# Altium schematic sheet Motor1_PCIe.SchDoc
size B
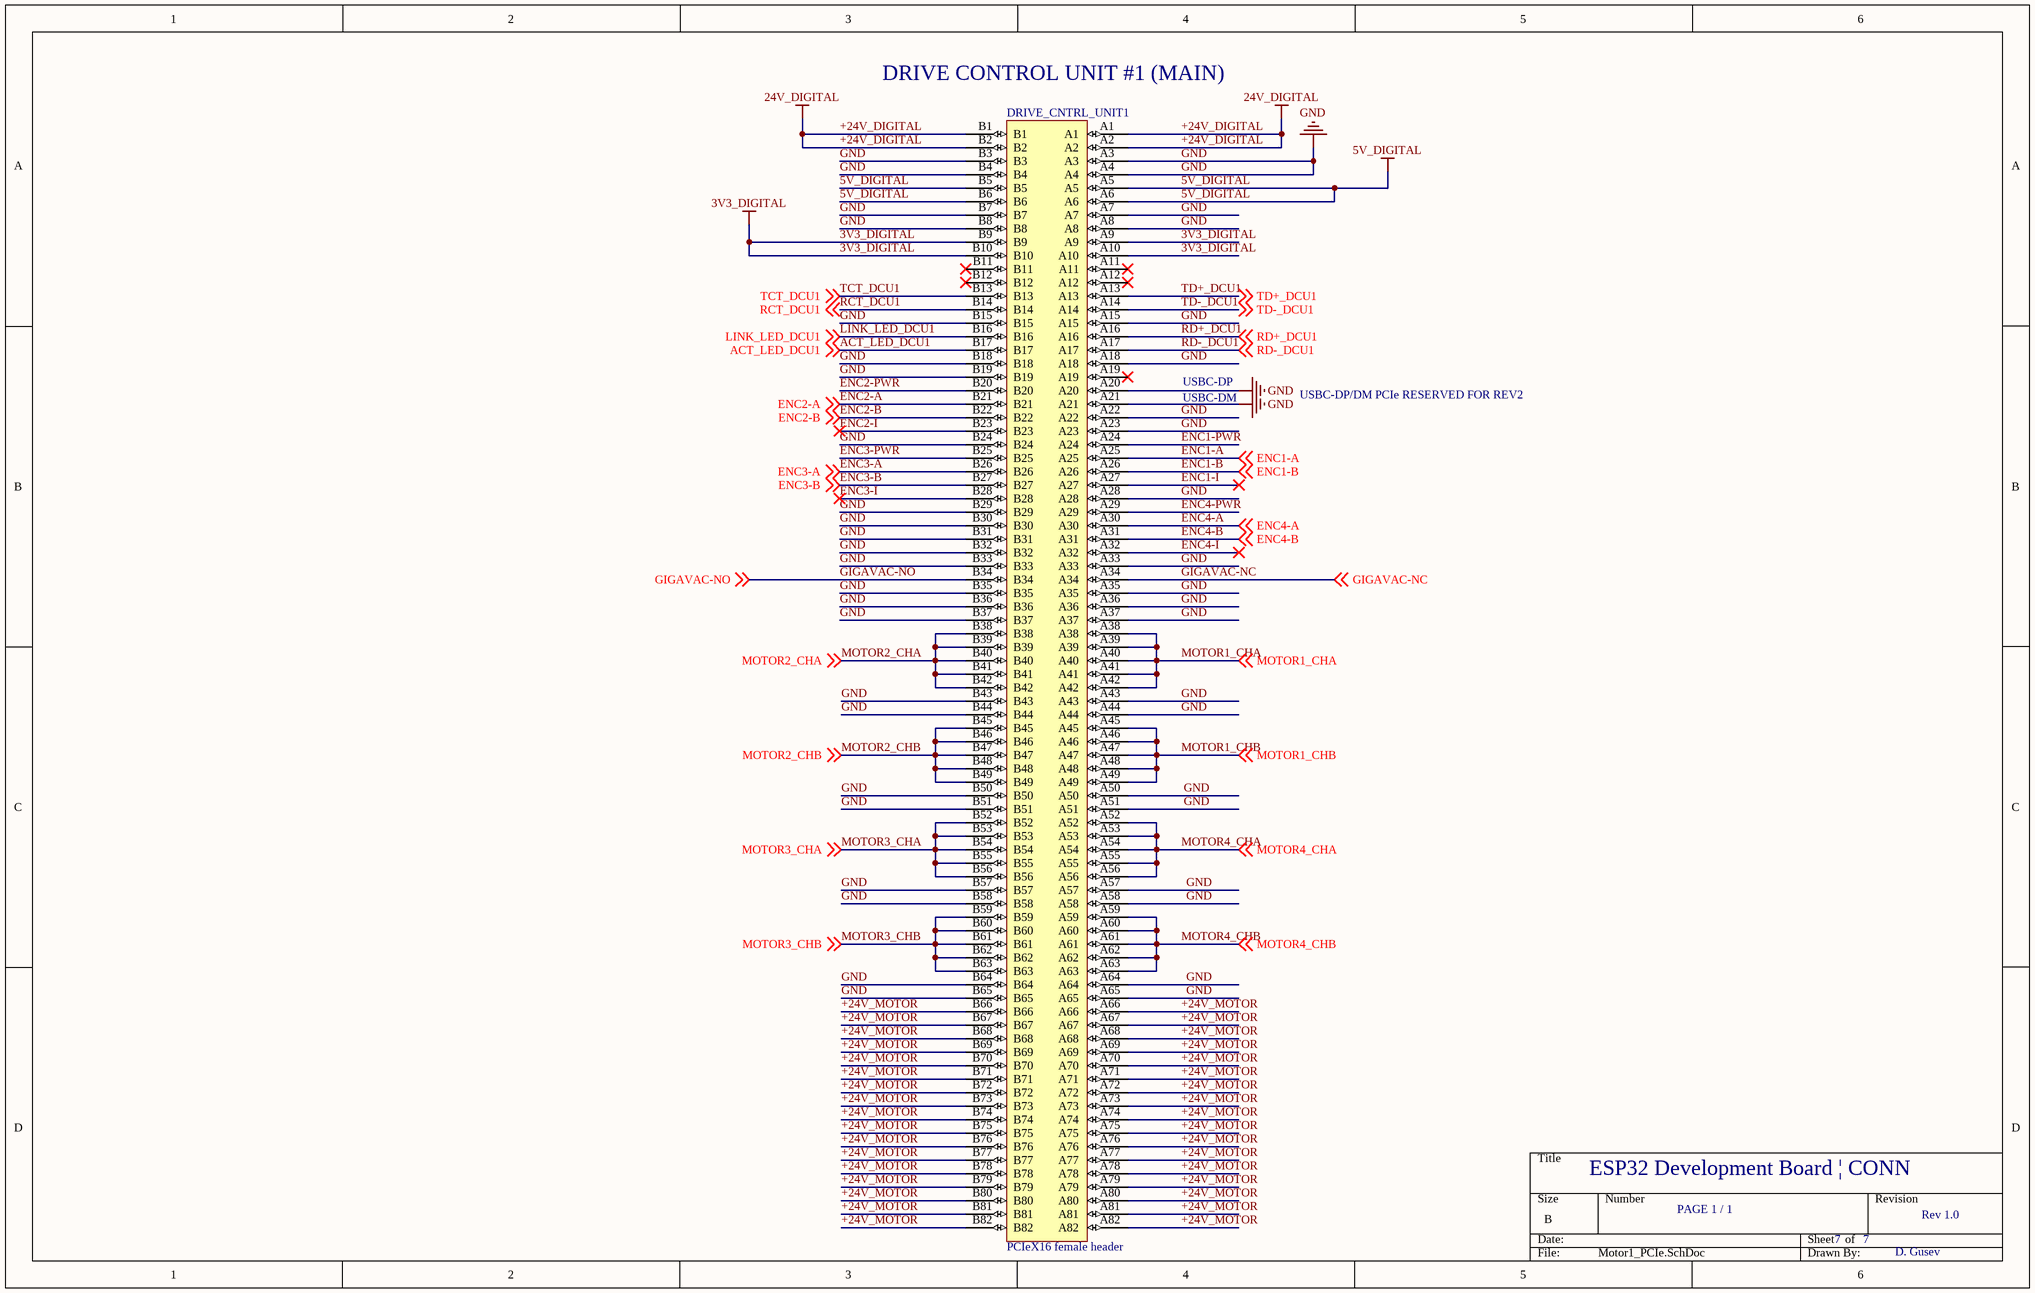
[diagram p0: Motor1_PCIe.SchDoc]

## Parts
DRIVE_CNTRL_UNIT1  PCIeX16 female header  [SAMTEC_PCIE-164-02-X-D-TH]

## Nets
3V3_DIGITAL: DRIVE_CNTRL_UNIT1.A9 DRIVE_CNTRL_UNIT1.A10 DRIVE_CNTRL_UNIT1.B9 DRIVE_CNTRL_UNIT1.B10
5V_DIGITAL: DRIVE_CNTRL_UNIT1.A5 DRIVE_CNTRL_UNIT1.A6 DRIVE_CNTRL_UNIT1.B5 DRIVE_CNTRL_UNIT1.B6
+24V_DIGITAL: DRIVE_CNTRL_UNIT1.A1 DRIVE_CNTRL_UNIT1.A2 DRIVE_CNTRL_UNIT1.B1 DRIVE_CNTRL_UNIT1.B2  [also labelled 24V_DIGITAL]
GND: DRIVE_CNTRL_UNIT1.A3 DRIVE_CNTRL_UNIT1.A4 DRIVE_CNTRL_UNIT1.A7 DRIVE_CNTRL_UNIT1.A8 DRIVE_CNTRL_UNIT1.A15 DRIVE_CNTRL_UNIT1.A18 DRIVE_CNTRL_UNIT1.A20 DRIVE_CNTRL_UNIT1.A21 DRIVE_CNTRL_UNIT1.A22 DRIVE_CNTRL_UNIT1.A23 DRIVE_CNTRL_UNIT1.A28 DRIVE_CNTRL_UNIT1.A33 DRIVE_CNTRL_UNIT1.A35 DRIVE_CNTRL_UNIT1.A36 DRIVE_CNTRL_UNIT1.A37 DRIVE_CNTRL_UNIT1.A43 DRIVE_CNTRL_UNIT1.A44 DRIVE_CNTRL_UNIT1.A50 DRIVE_CNTRL_UNIT1.A51 DRIVE_CNTRL_UNIT1.A57 DRIVE_CNTRL_UNIT1.A58 DRIVE_CNTRL_UNIT1.A64 DRIVE_CNTRL_UNIT1.A65 DRIVE_CNTRL_UNIT1.B3 DRIVE_CNTRL_UNIT1.B4 DRIVE_CNTRL_UNIT1.B7 DRIVE_CNTRL_UNIT1.B8 DRIVE_CNTRL_UNIT1.B15 DRIVE_CNTRL_UNIT1.B18 DRIVE_CNTRL_UNIT1.B19 DRIVE_CNTRL_UNIT1.B24 DRIVE_CNTRL_UNIT1.B29 DRIVE_CNTRL_UNIT1.B30 DRIVE_CNTRL_UNIT1.B31 DRIVE_CNTRL_UNIT1.B32 DRIVE_CNTRL_UNIT1.B33 DRIVE_CNTRL_UNIT1.B35 DRIVE_CNTRL_UNIT1.B36 DRIVE_CNTRL_UNIT1.B37 DRIVE_CNTRL_UNIT1.B43 DRIVE_CNTRL_UNIT1.B44 DRIVE_CNTRL_UNIT1.B50 DRIVE_CNTRL_UNIT1.B51 DRIVE_CNTRL_UNIT1.B57 DRIVE_CNTRL_UNIT1.B58 DRIVE_CNTRL_UNIT1.B64 DRIVE_CNTRL_UNIT1.B65
+24V_MOTOR: DRIVE_CNTRL_UNIT1.A66 DRIVE_CNTRL_UNIT1.A67 DRIVE_CNTRL_UNIT1.A68 DRIVE_CNTRL_UNIT1.A69 DRIVE_CNTRL_UNIT1.A70 DRIVE_CNTRL_UNIT1.A71 DRIVE_CNTRL_UNIT1.A72 DRIVE_CNTRL_UNIT1.A73 DRIVE_CNTRL_UNIT1.A74 DRIVE_CNTRL_UNIT1.A75 DRIVE_CNTRL_UNIT1.A76 DRIVE_CNTRL_UNIT1.A77 DRIVE_CNTRL_UNIT1.A78 DRIVE_CNTRL_UNIT1.A79 DRIVE_CNTRL_UNIT1.A80 DRIVE_CNTRL_UNIT1.A81 DRIVE_CNTRL_UNIT1.A82 DRIVE_CNTRL_UNIT1.B66 DRIVE_CNTRL_UNIT1.B67 DRIVE_CNTRL_UNIT1.B68 DRIVE_CNTRL_UNIT1.B69 DRIVE_CNTRL_UNIT1.B70 DRIVE_CNTRL_UNIT1.B71 DRIVE_CNTRL_UNIT1.B72 DRIVE_CNTRL_UNIT1.B73 DRIVE_CNTRL_UNIT1.B74 DRIVE_CNTRL_UNIT1.B75 DRIVE_CNTRL_UNIT1.B76 DRIVE_CNTRL_UNIT1.B77 DRIVE_CNTRL_UNIT1.B78 DRIVE_CNTRL_UNIT1.B79 DRIVE_CNTRL_UNIT1.B80 DRIVE_CNTRL_UNIT1.B81 DRIVE_CNTRL_UNIT1.B82
ACT_LED_DCU1: DRIVE_CNTRL_UNIT1.B17 ; off-sheet ACT_LED_DCU1
ENC1-A: DRIVE_CNTRL_UNIT1.A25 ; off-sheet ENC1-A
ENC1-B: DRIVE_CNTRL_UNIT1.A26 ; off-sheet ENC1-B
ENC1-I: DRIVE_CNTRL_UNIT1.A27
ENC1-PWR: DRIVE_CNTRL_UNIT1.A24
ENC2-A: DRIVE_CNTRL_UNIT1.B21 ; off-sheet ENC2-A
ENC2-B: DRIVE_CNTRL_UNIT1.B22 ; off-sheet ENC2-B
ENC2-I: DRIVE_CNTRL_UNIT1.B23
ENC2-PWR: DRIVE_CNTRL_UNIT1.B20
ENC3-A: DRIVE_CNTRL_UNIT1.B26 ; off-sheet ENC3-A
ENC3-B: DRIVE_CNTRL_UNIT1.B27 ; off-sheet ENC3-B
ENC3-I: DRIVE_CNTRL_UNIT1.B28
ENC3-PWR: DRIVE_CNTRL_UNIT1.B25
ENC4-A: DRIVE_CNTRL_UNIT1.A30 ; off-sheet ENC4-A
ENC4-B: DRIVE_CNTRL_UNIT1.A31 ; off-sheet ENC4-B
ENC4-I: DRIVE_CNTRL_UNIT1.A32
ENC4-PWR: DRIVE_CNTRL_UNIT1.A29
GIGAVAC-NC: DRIVE_CNTRL_UNIT1.A34 ; off-sheet GIGAVAC-NC
GIGAVAC-NO: DRIVE_CNTRL_UNIT1.B34 ; off-sheet GIGAVAC-NO
LINK_LED_DCU1: DRIVE_CNTRL_UNIT1.B16 ; off-sheet LINK_LED_DCU1
MOTOR1_CHA: DRIVE_CNTRL_UNIT1.A38 DRIVE_CNTRL_UNIT1.A39 DRIVE_CNTRL_UNIT1.A40 DRIVE_CNTRL_UNIT1.A41 DRIVE_CNTRL_UNIT1.A42 ; off-sheet MOTOR1_CHA
MOTOR1_CHB: DRIVE_CNTRL_UNIT1.A45 DRIVE_CNTRL_UNIT1.A46 DRIVE_CNTRL_UNIT1.A47 DRIVE_CNTRL_UNIT1.A48 DRIVE_CNTRL_UNIT1.A49 ; off-sheet MOTOR1_CHB
MOTOR2_CHA: DRIVE_CNTRL_UNIT1.B38 DRIVE_CNTRL_UNIT1.B39 DRIVE_CNTRL_UNIT1.B40 DRIVE_CNTRL_UNIT1.B41 DRIVE_CNTRL_UNIT1.B42 ; off-sheet MOTOR2_CHA
MOTOR2_CHB: DRIVE_CNTRL_UNIT1.B45 DRIVE_CNTRL_UNIT1.B46 DRIVE_CNTRL_UNIT1.B47 DRIVE_CNTRL_UNIT1.B48 DRIVE_CNTRL_UNIT1.B49 ; off-sheet MOTOR2_CHB
MOTOR3_CHA: DRIVE_CNTRL_UNIT1.B52 DRIVE_CNTRL_UNIT1.B53 DRIVE_CNTRL_UNIT1.B54 DRIVE_CNTRL_UNIT1.B55 DRIVE_CNTRL_UNIT1.B56 ; off-sheet MOTOR3_CHA
MOTOR3_CHB: DRIVE_CNTRL_UNIT1.B59 DRIVE_CNTRL_UNIT1.B60 DRIVE_CNTRL_UNIT1.B61 DRIVE_CNTRL_UNIT1.B62 DRIVE_CNTRL_UNIT1.B63 ; off-sheet MOTOR3_CHB
MOTOR4_CHA: DRIVE_CNTRL_UNIT1.A52 DRIVE_CNTRL_UNIT1.A53 DRIVE_CNTRL_UNIT1.A54 DRIVE_CNTRL_UNIT1.A55 DRIVE_CNTRL_UNIT1.A56 ; off-sheet MOTOR4_CHA
MOTOR4_CHB: DRIVE_CNTRL_UNIT1.A59 DRIVE_CNTRL_UNIT1.A60 DRIVE_CNTRL_UNIT1.A61 DRIVE_CNTRL_UNIT1.A62 DRIVE_CNTRL_UNIT1.A63 ; off-sheet MOTOR4_CHB
RCT_DCU1: DRIVE_CNTRL_UNIT1.B14 ; off-sheet RCT_DCU1
RD+_DCU1: DRIVE_CNTRL_UNIT1.A16 ; off-sheet RD+_DCU1
RD-_DCU1: DRIVE_CNTRL_UNIT1.A17 ; off-sheet RD-_DCU1
TCT_DCU1: DRIVE_CNTRL_UNIT1.B13 ; off-sheet TCT_DCU1
TD+_DCU1: DRIVE_CNTRL_UNIT1.A13 ; off-sheet TD+_DCU1
TD-_DCU1: DRIVE_CNTRL_UNIT1.A14 ; off-sheet TD-_DCU1

Not connected (* = marked no-connect by the designer): DRIVE_CNTRL_UNIT1 A11* A12* A19* B11* B12*

## Notes on the sheet
- (near DRIVE_CNTRL_UNIT1) DRIVE CONTROL UNIT #1 (MAIN)
- USBC-DP
- USBC-DM
- USBC-DP/DM PCIe RESERVED FOR REV2
- ESP32 Development Board | CONN
- PAGE 1 / 1
- 7
- Rev 1.0
- D. Gusev

## Library data of the parts
DRIVE_CNTRL_UNIT1 = PCIeX16 female header: 164-position SAMTEC female header